# Altium project Robonauts.PrjPcb
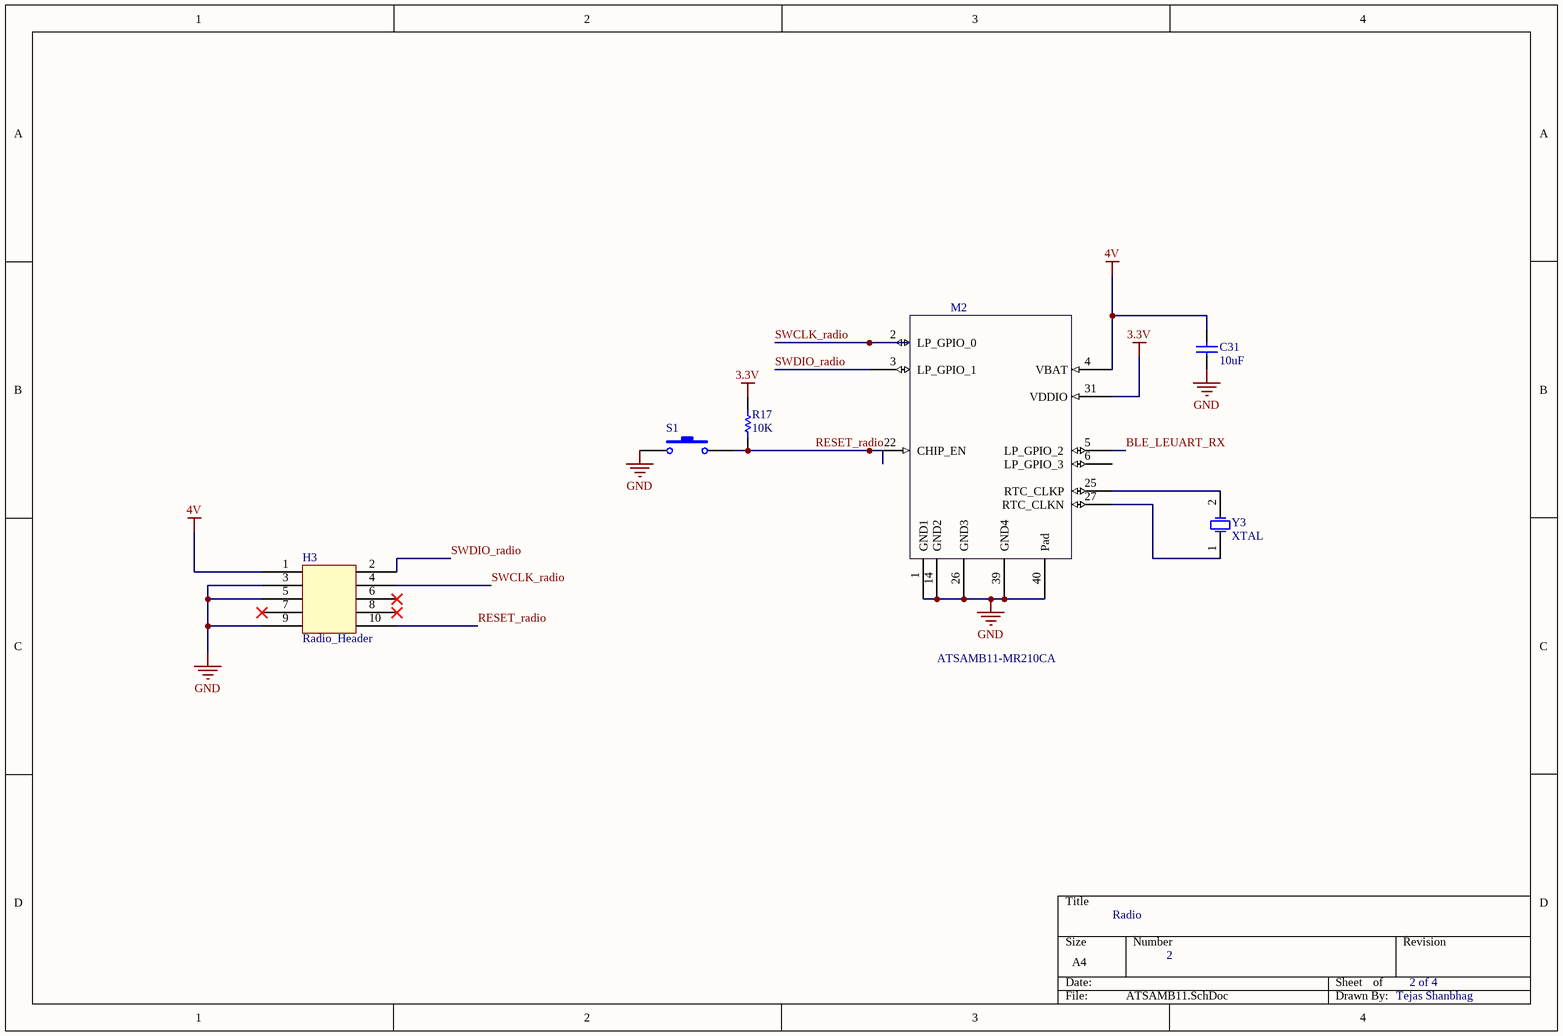
[diagram p0: ATSAMB11.SchDoc]
4 sheets, 119 parts. Net scope: global (net labels, ports and power ports of the same name join across sheets).
Board file: PCB1_Tejas.PcbDoc
Sheets:
  ATSAMB11.SchDoc
  sensors.SchDoc
  powermanage.SchDoc
  Microcontroller_rev2.SchDoc

## Sheet ATSAMB11.SchDoc
size A4

### Parts
C31  value 10uF  [1608[0603]]  (hidden comment: Cap Semi)
H3  Radio_Header  [Cortex Debug Header]
M2  ATSAMB11-MR210CA  [ATMELSAMB11]
R17  value 10K  [1608[0603]]  (hidden comment: Res1)
S1  SW-PB  [RESET]  (value not drawn)
Y3  XTAL  [Clock_LFXTAL]

### Nets
3.3V: M2.31(VDDIO) R17.2
4V: C31.2 H3.1 M2.4(VBAT)
GND: C31.1 H3.3 H3.5 H3.9 M2.1(GND1) M2.14(GND2) M2.26(GND3) M2.39(GND4) M2.40(Pad) S1.1
BLE_LEUART_RX: M2.5(LP_GPIO_2)
RESET_radio: H3.10 M2.22(CHIP_EN) R17.1 S1.2
SWCLK_radio: H3.4 M2.2(LP_GPIO_0)
SWDIO_radio: H3.2 M2.3(LP_GPIO_1)
NetM2_25: M2.25(RTC_CLKP) Y3.2(OSC2)
NetM2_27: M2.27(RTC_CLKN) Y3.1(OSC1)

Not connected (* = marked no-connect by the designer): H3 6* 7* 8*; M2 6(LP_GPIO_3)

### Notes on the sheet
- Radio
- 2
- 2 of 4
- Tejas Shanbhag

### Library data of the parts
C31 = Cap Semi: CAP CER 10UF 10V X5R 0603; Manufacturer: Murata Electronics North America; Manufacturer Part Number: GRM188R61A106KE69D; ComponentLink1Description: Datasheet; ComponentLink1URL: http://search.murata.co.jp/Ceramy/image/img/A01X/partnumbering_e_01.pdf; Digikey Part No: 490-10474-1-ND
H3 = Radio_Header: CONN HDR 1.27MM SMD AU 10POS; Manufacturer: Harwin Inc.; Manufacturer Part Number: M50-3600542; ComponentLink1Description: Datasheet; ComponentLink1URL: https://cdn.harwin.com/pdfs/M50-360.pdf; Digikey Part No: 952-1389-ND
M2 = ATSAMB11: Bluetooth / 802.15.1 Modules Chip Antenna UFL connector MU-T; Manufacturer: Microchip Technology/Atmel; Manufacturer Part Number: ATSAMB11-MR210CA; Mouser Part No: 556-ATSAMB11-MR210CA; ComponentLink1URL: http://www.mouser.com/ProductDetail/Atmel/ATSAMB11-MR210CA/?qs=ma0NyvTRVt1T4DTX%252bAca0w==; ComponentLink1Description: link
R17 = Res1: RES SMD 10K OHM 1% 1/10W 0603; Manufacturer: Yageo; Manufacturer Part Number: RC0603FR-0710KL; ComponentLink1Description: Datasheet; ComponentLink1URL: http://www.yageo.com.tw/exep/pages/download/literatures/PYu-R_INT-thick_7.pdf; Digikey Part No: 311-10.0KHRCT-ND
S1 = SW-PB: SWITCH TACTILE SPST-NO 0.05A 15V; Manufacturer Part Number: TL3315NF160Q; Manufacturer: E-Switch; ComponentLink1Description: Datasheet; ComponentLink1URL: https://media.digikey.com/pdf/Data%20Sheets/E-Switch%20PDFs/TL3315.pdf; Digikey Part No: EG4621CT-ND
Y3 = XTAL: CRYSTAL 32.7680KHZ 12.5PF SMD; Manufacturer Part Number: AB26TRQ-32.768KHZ-T; Manufacturer: Abracon LLC; Value: 32.768kHz; ComponentLink1URL: https://www.digikey.com/products/en/crystals-oscillators-resonators/crystals/171?k=+AB26TRQ&k=&pkeyword=+AB26TRQ&pv7=2&mnonly=0&newproducts=0&ColumnSort=0&page=1&quantity=0&ptm=0&fid=0&pageSize=25; Digikey Part No: 535-12051-1-ND; ComponentLink1Description: link

## Sheet sensors.SchDoc
size A4
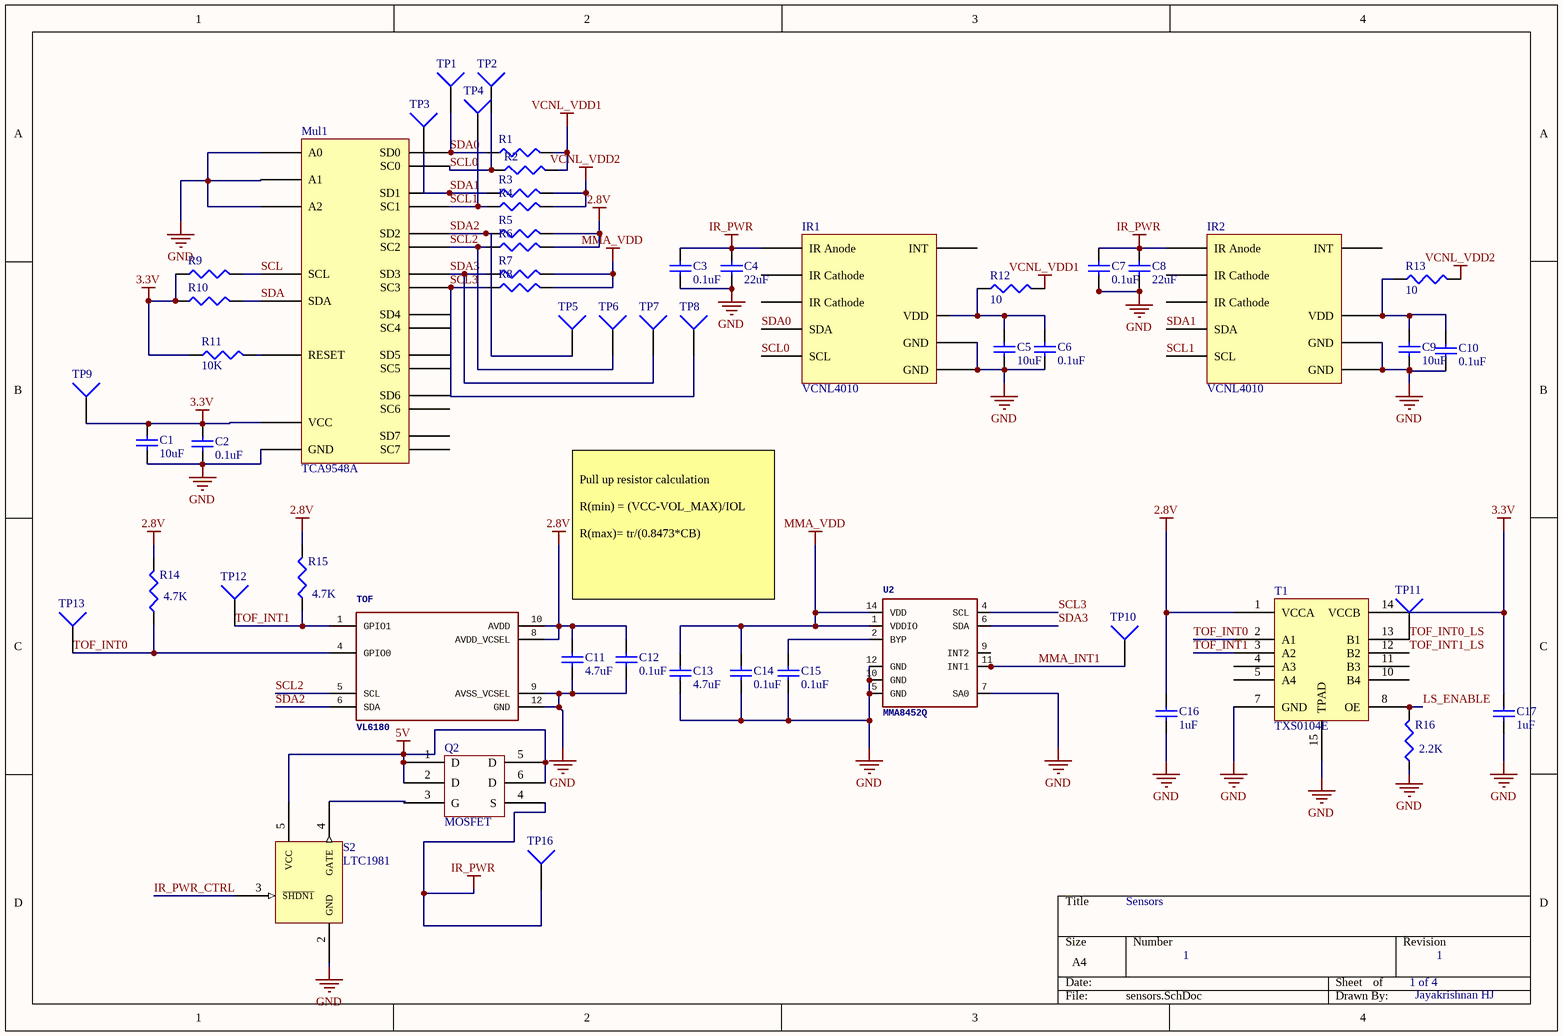
[diagram p1: sensors.SchDoc]

### Parts
C1  value 10uF  [1608[0603]]  (hidden comment: Cap Semi)
C2  value 0.1uF  [1608[0603]]  (hidden comment: Cap Semi)
C3  value 0.1uF  [1608[0603]]  (hidden comment: Cap Semi)
C4  value 22uF  [1608[0603]]  (hidden comment: Cap Semi)
C5  value 10uF  [1608[0603]]  (hidden comment: Cap Semi)
C6  value 0.1uF  [1608[0603]]  (hidden comment: Cap Semi)
C7  value 0.1uF  [1608[0603]]  (hidden comment: Cap Semi)
C8  value 22uF  [1608[0603]]  (hidden comment: Cap Semi)
C9  value 10uF  [1608[0603]]  (hidden comment: Cap Semi)
C10  value 0.1uF  [1608[0603]]  (hidden comment: Cap Semi)
C11  value 4.7uF  [1608[0603]]  (hidden comment: Cap Semi)
C12  value 0.1uF  [1608[0603]]  (hidden comment: Cap Semi)
C13  value 4.7uF  [1608[0603]]  (hidden comment: Cap Semi)
C14  value 0.1uF  [1608[0603]]  (hidden comment: Cap Semi)
C15  value 0.1uF  [1608[0603]]  (hidden comment: Cap Semi)
C16  value 1uF  [1608[0603]]  (hidden comment: Cap Semi)
C17  value 1uF  [1608[0603]]  (hidden comment: Cap Semi)
IR1  VCNL4010  [13-WQFN]
IR2  VCNL4010  [13-WQFN]
Mul1  TCA9548A  [TTSOP MULTIPLEXER]
Q2  MOSFET  [MOSFET SI3442]
R1  Res3  [J1-0603]  (value not drawn)
R2  Res3  [J1-0603]  (value not drawn)
R3  Res3  [J1-0603]  (value not drawn)
R4  Res3  [J1-0603]  (value not drawn)
R5  Res3  [J1-0603]  (value not drawn)
R6  Res3  [J1-0603]  (value not drawn)
R7  Res3  [J1-0603]  (value not drawn)
R8  Res3  [J1-0603]  (value not drawn)
R9  Res3  [J1-0603]  (value not drawn)
R10  Res3  [J1-0603]  (value not drawn)
R11  value 10K  [J1-0603]  (hidden comment: Res3)
R12  value 10  [J1-0603]  (hidden comment: Res3)
R13  value 10  [J1-0603]  (hidden comment: Res3)
R14  value 4.7K  [1608[0603]]  (hidden comment: Res3)
R15  value 4.7K  [1608[0603]]  (hidden comment: Res3)
R16  value 2.2K  [J1-0603]  (hidden comment: Res3)
S2  LTC1981  [LTC1981]
T1  TXS0104E  [txs0104e]
TOF  VL6180  [VL6180]
TP1  Socket  [PIN1]  (value not drawn)
TP2  Socket  [PIN1]  (value not drawn)
TP3  Socket  [PIN1]  (value not drawn)
TP4  Socket  [PIN1]  (value not drawn)
TP5  Socket  [PIN1]  (value not drawn)
TP6  Socket  [PIN1]  (value not drawn)
TP7  Socket  [PIN1]  (value not drawn)
TP8  Socket  [PIN1]  (value not drawn)
TP9  Socket  [PIN1]  (value not drawn)
TP10  Socket  [PIN1]  (value not drawn)
TP11  Socket  [PIN1]  (value not drawn)
TP12  Socket  [PIN1]  (value not drawn)
TP13  Socket  [PIN1]  (value not drawn)
TP16  Socket  [PIN1]  (value not drawn)
U2  MMA8452Q  [MMA8452Q_jk]

### Nets
2.8V: C11.2 C12.2 C16.2 R5.2 R6.2 R14.2 R15.2 T1.1(VCCA) TOF.8(AVDD_VCSEL) TOF.10(AVDD)
3.3V: C1.2 C2.2 C17.2 Mul1.24(VCC) R9.1 R10.1 R11.1 T1.14(VCCB) TP9.1
5V: Q2.1(D) Q2.2(D) Q2.5(D) Q2.6(D) S2.5(VCC)
GND: C1.1 C2.1 C3.1 C4.1 C5.1 C6.1 C7.1 C8.1 C9.1 C10.1 C11.1 C12.1 C13.1 C14.1 C15.1 C16.1 C17.1 IR1.12(GND) IR1.13(GND) IR2.12(GND) IR2.13(GND) Mul1.1(A0) Mul1.2(A1) Mul1.12(GND) Mul1.21(A2) R16.1 S2.2(GND) T1.7(GND) T1.15(TPAD) TOF.9(AVSS_VCSEL) TOF.12(GND) U2.5(GND) U2.7(SA0) U2.10(GND) U2.12(GND)
IR_PWR: C3.2 C4.2 C7.2 C8.2 IR1.1(IR_Anode) IR2.1(IR_Anode) Q2.4(S) TP16.1
MMA_VDD: C13.2 C14.2 R7.2 R8.2 U2.1(VDDIO) U2.14(VDD)
VCNL_VDD1: R1.2 R2.2 R12.2
VCNL_VDD2: R3.2 R4.2 R13.2
IR_PWR_CTRL: S2.3(~{SHDN1})
LS_ENABLE: R16.2 T1.8(OE)
MMA_INT1: TP10.1 U2.11(INT1)
SCL: Mul1.22(SCL) R9.2
SCL0: IR1.5(SCL) Mul1.5(SC0) R2.1 TP2.1
SCL1: IR2.5(SCL) Mul1.7(SC1) R4.1 TP4.1
SCL2: Mul1.9(SC2) R6.1 TOF.5(SCL) TP6.1
SCL3: Mul1.11(SC3) R8.1 TP8.1 U2.4(SCL)
SDA: Mul1.23(SDA) R10.2
SDA0: IR1.4(SDA) Mul1.4(SD0) R1.1 TP1.1
SDA1: IR2.4(SDA) Mul1.6(SD1) R3.1 TP3.1
SDA2: Mul1.8(SD2) R5.1 TOF.6(SDA) TP5.1
SDA3: Mul1.10(SD3) R7.1 TP7.1 U2.6(SDA)
TOF_INT0: R14.1 T1.2(A1) TOF.4(GPIO0) TP13.1
TOF_INT0_LS: T1.13(B1) TP11.1
TOF_INT1: R15.1 T1.3(A2) TOF.1(GPIO1) TP12.1
TOF_INT1_LS: T1.12(B2)
NetC5_2: C5.2 C6.2 IR1.7(VDD) R12.1
NetC9_2: C9.2 C10.2 IR2.7(VDD) R13.1
NetC15_2: C15.2 U2.2(BYP)
NetMul1_3: Mul1.3(RESET) R11.2
NetQ2_3: Q2.3(G) S2.4(GATE)

Not connected (* = marked no-connect by the designer): IR1 2(IR_Cathode) 3(IR_Cathode) 6(INT); IR2 2(IR_Cathode) 3(IR_Cathode) 6(INT); Mul1 13(SD4) 14(SC4) 15(SD5) 16(SC5) 17(SD6) 18(SC6) 19(SD7) 20(SC7); T1 4(A3) 5(A4) 10(B4) 11(B3); U2 9(INT2)

### Notes on the sheet
- Pull up resistor calculation
  R(min) = (VCC-VOL_MAX)/IOL
  R(max)= tr/(0.8473*CB)
- Sensors
- 1
- 1 of 4
- Jayakrishnan HJ

### Library data of the parts
C1 C5 C9 = Cap Semi: as C31 on sheet ATSAMB11; ComponentLink1Description: Datasheet; ComponentLink1URL: http://search.murata.co.jp/Ceramy/image/img/A01X/partnumbering_e_01.pdf; Digikey Part No: 490-10474-1-ND
C2 C3 C6 C7 C10 C12 C14 C15 = Cap Semi: CAP CER 0.1UF 10V X7R 0603; Manufacturer: KEMET; Manufacturer Part Number: C0603C104K8RACTU; ComponentLink1Description: Datasheet; ComponentLink1URL: http://www.kemet.com/Lists/ProductCatalog/Attachments/53/KEM_C1002_X7R_SMD.pdf; Digikey Part No: 399-1095-1-ND
C4 C8 = Cap Semi: CAP CER 22UF 6.3V X5R 0603; Manufacturer: Murata Electronics North America; Manufacturer Part Number: GRM188R60J226MEA0D; ComponentLink1Description: Datasheet; ComponentLink1URL: http://search.murata.co.jp/Ceramy/image/img/A01X/partnumbering_e_01.pdf; Digikey Part No: 490-7611-1-ND
C11 C13 = Cap Semi: CAP CER 4.7UF 10V X5R 0603; Manufacturer: Murata Electronics North America; Manufacturer Part Number: GRM188R61A475KE15D; ComponentLink1Description: Datasheet; ComponentLink1URL: http://search.murata.co.jp/Ceramy/image/img/A01X/partnumbering_e_01.pdf; Digikey Part No: 490-10477-1-ND
C16 C17 = Cap Semi: CAP CER 1UF 10V X7R 0603; Manufacturer: Samsung Electro-Mechanics America, Inc.; Manufacturer Part Number: CL10B105KP8NNNC; ComponentLink1Description: Datasheet; ComponentLink1URL: http://www.digikey.com/product-detail/en/samsung-electro-mechanics-america-inc/CL10B105KP8NNNC/1276-1946-1-ND/3890032; Digikey Part No: 1276-1946-1-ND
IR1 = VCNL4010: SENS IR PROXIMITY AMB LT 12LLP; Manufacturer: Vishay Semiconductor Opto Division; Manufacturer Part Number: VCNL4010-GS08; Digikey Part Number: VCNL4010-GS08CT-ND; ComponentLink1Description: Datasheet; ComponentLink1URL: https://www.digikey.com/products/en/sensors-transducers/optical-sensors-ambient-light-ir-uv-sensors/536?k=vcnl+4010&k=&pkeyword=vcnl+4010&pv7=2&pv16=14926&FV=ffe00218&mnonly=0&newproducts=0&ColumnSort=0&page=1&quantity=0&ptm=0&fid=0&pageSize=25; Value: *
IR2 = VCNL4010: SENS IR PROXIMITY AMB LT 12LLP; Manufacturer Part Number: VCNL4010-GS08; Manufacturer: Vishay Semiconductor Opto Division; ComponentLink1Description: link; Digikey Part No: VCNL4010-GS08CT-ND; ComponentLink1URL: https://www.digikey.com/products/en/sensors-transducers/optical-sensors-ambient-light-ir-uv-sensors/536?k=vcnl+4010&k=&pkeyword=vcnl+4010&pv7=2&pv16=14926&FV=ffe00218&mnonly=0&newproducts=0&ColumnSort=0&page=1&quantity=0&ptm=0&fid=0&pageSize=25
Mul1 = TCA9548A: IC I2C SW 8CH W/RESET 24TSSOP; Manufacturer: Texas Instruments; Manufacturer Part Number: TCA9548APWR; Digikey Part Number: 296-34905-1-ND; ComponentLink1Description: LINK; ComponentLink1URL: https://www.digikey.com/products/en/integrated-circuits-ics/logic-signal-switches-multiplexers-decoders/743?k=tca9548a&k=&pkeyword=tca9548a&pv7=2&pv1291=24&FV=ffe002e7&mnonly=0&newproducts=0&ColumnSort=0&page=1&quantity=0&ptm=0&fid=0&pageSize=25; Value: *
Q2 = MOSFET: MOSFET N-CH 20V 3A 6-TSOP; Manufacturer Part Number: SI3442BDV-T1-E3; Manufacturer: Vishay Siliconix; ComponentLink1URL: https://www.digikey.com/product-detail/en/vishay-siliconix/SI3442BDV-T1-E3/SI3442BDV-T1-E3CT-ND/1656865; Digikey Part No: SI3442BDV-T1-E3CT-ND; Value: *; ComponentLink1Description: link
R1-R10 R14 R15 = Res3: RES SMD 4.7K OHM 5% 1/10W 0603; Manufacturer: Yageo; Manufacturer Part Number: RC0603JR-074K7L; ComponentLink1URL: http://www.digikey.com/product-detail/en/yageo/RC0603JR-074K7L/311-4.7KGRCT-ND/729732; ComponentLink1Description: Datasheet; Digikey Part No: 311-4.7KGRCT-ND
  R1-R10: Value: 4.7K
R11 = Res3: RES SMD 10K OHM 5% 1/16W 0402; Manufacturer: Yageo; Manufacturer Part Number: RC0402JR-0710KL; ComponentLink1URL: http://www.digikey.com/product-detail/en/yageo/RC0402JR-0710KL/311-10KJRCT-ND/729365; ComponentLink1Description: Datasheet; Digikey Part No: 311-10KJRCT-ND
R12 R13 = Res3: RES SMD 10 OHM 1% 1/10W 0603; Manufacturer: Yageo; Manufacturer Part Number: RC0603FR-0710RL; ComponentLink1URL: http://www.digikey.com/product-detail/en/yageo/RC0603FR-0710RL/311-10.0HRCT-ND/729826; ComponentLink1Description: Datasheet; Digikey Part No: 311-10.0HRCT-ND
R16 = Res3: RES SMD 2.2K OHM 1% 1/16W 0402; Manufacturer: Yageo; Manufacturer Part Number: RC0402FR-072K2L; ComponentLink1URL: http://www.digikey.com/product-detail/en/yageo/RC0402FR-072K2L/311-2.20KLRCT-ND/729500; ComponentLink1Description: Datasheet; Digikey Part No: 311-2.20KLRCT-ND
S2 = LTC1981: IC HI-SIDE SW CTRL SNGL TSOT23-5; Manufacturer Part Number: LTC1981ES5#TRMPBF; Manufacturer: Linear Technology; ComponentLink1Description: link; ComponentLink1URL: https://www.digikey.com/products/en/integrated-circuits-ics/pmic-gate-drivers/730?k=ltc1981&k=&pkeyword=ltc1981&pv7=2&mnonly=0&newproducts=0&ColumnSort=0&page=1&quantity=0&ptm=0&fid=0&pageSize=25; Value: *; Digikey Part No: LTC1981ES5#TRMPBFCT-ND
T1 = TXS0104E: IC 4BIT NON-INV TRANSLTR 14-QFN; Manufacturer Part Number: TXS0104ERGYR; Manufacturer: Texas Instruments; Value: *; ComponentLink1Description: link; ComponentLink1URL: https://www.digikey.com/product-detail/en/texas-instruments/TXS0104ERGYR/296-20698-1-ND/1143682; Digikey Part No: 296-20698-1-ND
TOF = VL6180: MOD TIME-OF-FLIGHT 3IN1 12LGA; Manufacturer: STMicroelectronics; Manufacturer Part Number: VL6180XV0NR/1; Digikey Part No: 497-14702-1-ND; ComponentLink1Description: link; Value: *; ComponentLink1URL: https://www.digikey.com/product-detail/en/stmicroelectronics/VL6180XV0NR-1/497-14702-1-ND/4854910
U2 = MMA8452Q: ACCELEROMETER 2-8G I2C 16QFN; Manufacturer: NXP USA Inc.; Manufacturer Part Number: MMA8452QR1; ComponentLink1URL: https://www.digikey.com/products/en/sensors-transducers/motion-sensors-accelerometers/515?k=mma8452Q&k=&pkeyword=mma8452Q&pv7=2&FV=ffe00203&mnonly=0&newproducts=0&ColumnSort=0&page=1&quantity=0&ptm=0&fid=0&pageSize=25; ComponentLink1Description: link; Digikey Part No: MMA8452QR1CT-ND; Value: *
TP1-TP13 TP16 = Socket: LatestRevisionDate: 17-Jul-2002; LatestRevisionNote: Re-released for DXP Platform.; Publisher: Altium Limited

## Sheet powermanage.SchDoc
size A4
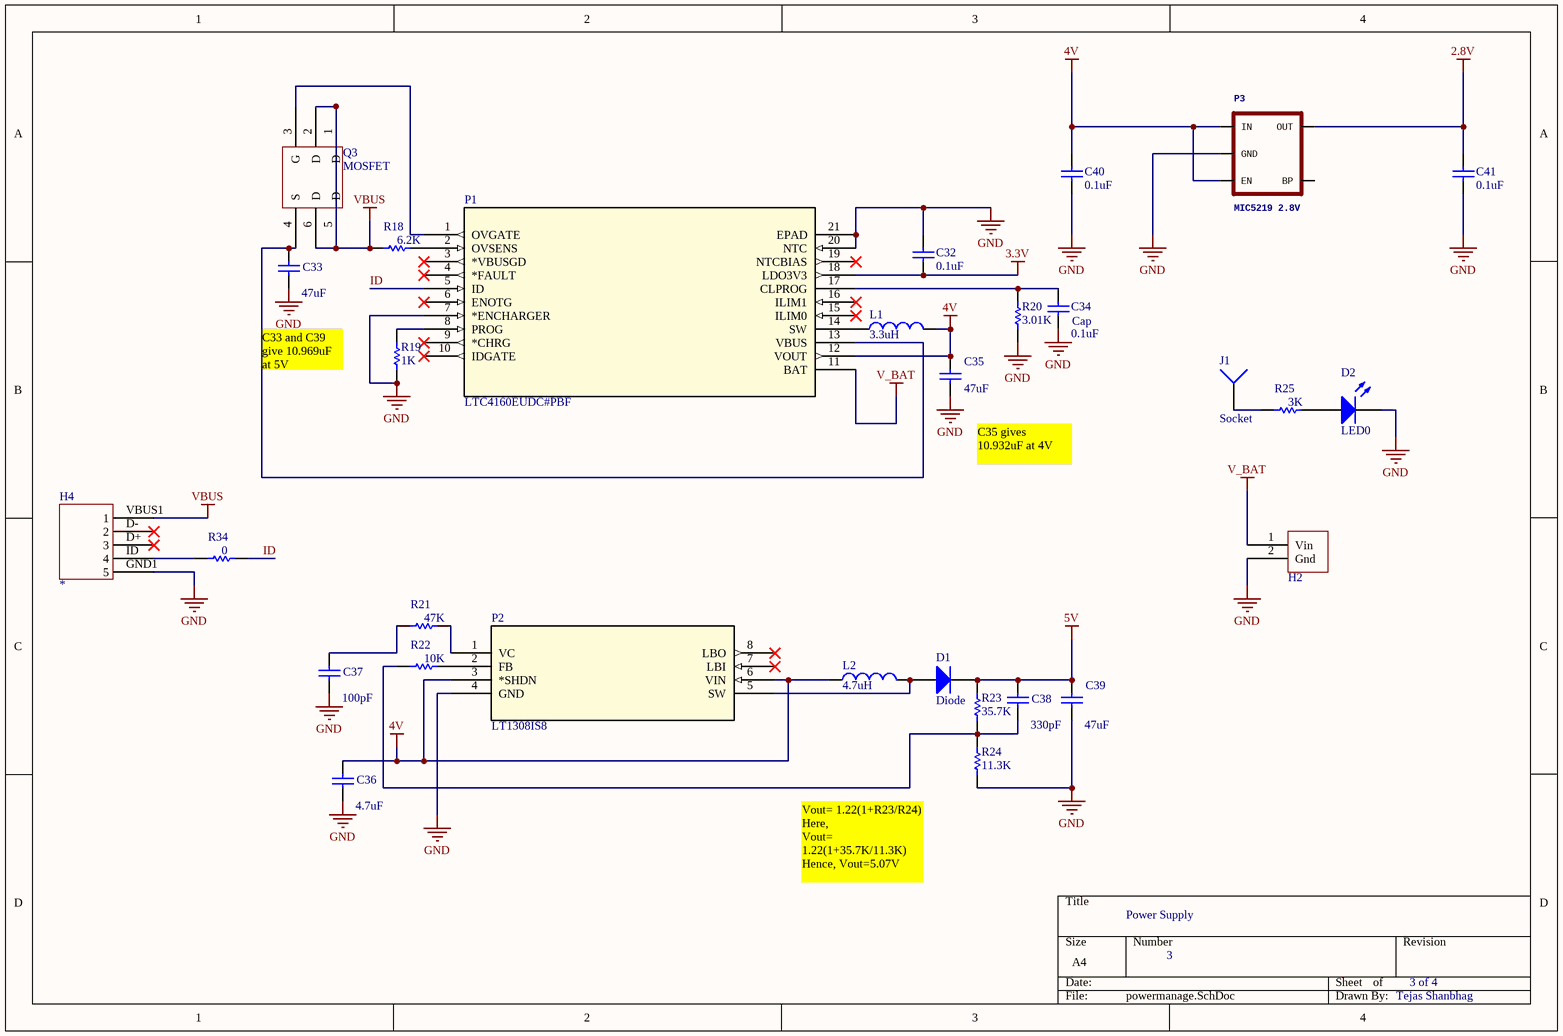
[diagram p2: powermanage.SchDoc]

### Parts
C32  value 0.1uF  [1608[0603]]  (hidden comment: Cap Semi)
C33  value 47uF  [6-0805_L]  (hidden comment: Cap)
C34  Cap  value 0.1uF  [1608[0603]]
C35  value 47uF  [1608[0603]]  (hidden comment: Cap)
C36  value 4.7uF  [1608[0603]]  (hidden comment: Cap)
C37  value 100pF  [1608[0603]]  (hidden comment: Cap)
C38  value 330pF  [1608[0603]]  (hidden comment: Cap)
C39  value 47uF  [6-0805_L]  (hidden comment: Cap)
C40  value 0.1uF  [1608[0603]]  (hidden comment: Cap Semi)
C41  value 0.1uF  [1608[0603]]  (hidden comment: Cap Semi)
D1  Diode  [1608[0603]]
D2  LED0  [LED-0603]
H2  Li-on  [battery]  (value not drawn)
H4  *  [MicroUSB_ConnOld]
J1  Socket  [PIN1]
L1  value 3.3uH  [1608[0603]]  (hidden comment: Inductor)
L2  value 4.7uH  [1608[0603]]  (hidden comment: Inductor)
P1  LTC4160EUDC#PBF  [LTC4160]
P2  LT1308IS8  [LTC1308]
P3  MIC5219 2.8V  [SOT23-5]
Q3  MOSFET  [MOSFET SI3442]
R18  value 6.2K  [1608[0603]]  (hidden comment: Res1)
R19  value 1K  [1608[0603]]  (hidden comment: Res1)
R20  value 3.01K  [1608[0603]]  (hidden comment: Res1)
R21  value 47K  [1608[0603]]  (hidden comment: Res1)
R22  value 10K  [1608[0603]]  (hidden comment: Res1)
R23  value 35.7K  [1608[0603]]  (hidden comment: Res1)
R24  value 11.3K  [1608[0603]]  (hidden comment: Res1)
R25  value 3K  [1608[0603]]  (hidden comment: Res1)
R34  value 0  [1608[0603]]  (hidden comment: Res1)

### Nets
2.8V: C41.2 P3.5(OUT)
3.3V: C32.1 P1.18(LDO3V3)
4V: C35.2 C36.2 C40.2 L1.2 L2.1 P1.12(VOUT) P2.3(*SHDN) P2.6(VIN) P3.1(IN) P3.3(EN)
5V: C38.2 C39.2 D1.2(K) R23.2
GND: C32.2 C33.1 C34.2 C35.1 C36.1 C37.1 C39.1 C40.1 C41.1 D2.2(K) H2.2(Gnd) H4.GND1(5) P1.7(*ENCHARGER) P1.20(NTC) P1.21(EPAD) P2.4(GND) P3.2(GND) R19.1 R20.2 R24.1
V_BAT: H2.1(Vin) P1.11(BAT)
VBUS: H4.VBUS1(1) Q3.1(D) Q3.2(D) Q3.5(D) Q3.6(D) R18.1
ID: P1.5(ID) R34.2
NetC33_2: C33.2 P1.13(VBUS) Q3.4(S)
NetC34_1: C34.1 P1.17(CLPROG) R20.1
NetC37_2: C37.2 R21.1
NetC38_1: C38.1 R22.1 R23.1 R24.2
NetD1_1: D1.1(A) L2.2 P2.5(SW)
NetD2_1: D2.1(A) R25.2
NetH4_ID: H4.ID(4) R34.1
NetJ1_1: J1.1 R25.1
NetL1_1: L1.1 P1.14(SW)
NetP1_1: P1.1(OVGATE) Q3.3(G)
NetP1_2: P1.2(OVSENS) R18.2
NetP1_8: P1.8(PROG) R19.2
NetP2_1: P2.1(VC) R21.2
NetP2_2: P2.2(FB) R22.2

Not connected (* = marked no-connect by the designer): H4 D+(3)* D-(2)*; P1 3(*VBUSGD)* 4(*FAULT)* 6(ENOTG)* 9(*CHRG)* 10(IDGATE)* 15(ILIM0)* 16(ILIM1)* 19(NTCBIAS)*; P2 7(LBI)* 8(LBO)*; P3 4(BP)

### Notes on the sheet
- C33 and C39 give 10.969uF at 5V
- (near C35) C35 gives 10.932uF at 4V
- Vout= 1.22(1+R23/R24)
  Here,
  Vout= 1.22(1+35.7K/11.3K)
  Hence, Vout=5.07V
- Power Supply
- 3
- 3 of 4
- Tejas Shanbhag

### Library data of the parts
C32 C40 C41 = Cap Semi: as C2 on sheet sensors; ComponentLink1Description: Datasheet; ComponentLink1URL: http://www.kemet.com/Lists/ProductCatalog/Attachments/53/KEM_C1002_X7R_SMD.pdf; Digikey Part No: 399-1095-1-ND
C33 C39 = Cap: CAP CER 47UF 6.3V X5R 0805; Manufacturer Part Number: GRM219R60J476ME44D; Manufacturer: Murata Electronics North America; Digikey Part No: 490-13249-1-ND; ComponentLink1Description: Datasheet; ComponentLink1URL: http://search.murata.co.jp/Ceramy/image/img/A01X/partnumbering_e_01.pdf
C34 = Cap: CAP CER 0.1UF 16V X7R 0603; Manufacturer Part Number: CC0603KRX7R7BB104; Manufacturer: Yageo; ComponentLink1Description: Datasheet; ComponentLink1URL: http://www.yageo.com/documents/recent/UPY-GPHC_X7R_6.3V-to-50V_17.pdf; Digikey Part No: 311-1088-1-ND
C35 = Cap: CAP CER 22UF 6.3V X5R 1206; Manufacturer Part Number: GRM188R60J476ME15D; Manufacturer: Murata Electronics North America; Digikey Part No: 490-13247-1-ND; ComponentLink1Description: Datasheet; ComponentLink1URL: http://search.murata.co.jp/Ceramy/image/img/A01X/partnumbering_e_01.pdf
C36 = Cap: CAP CER 4.7UF 6.3V X7R 0603; Manufacturer Part Number: CL10B475KQ8NQNC; Manufacturer: Samsung Electro-Mechanics America, Inc.; Digikey Part No: 1276-2087-1-ND; ComponentLink1Description: Datasheet; ComponentLink1URL: http://media.digikey.com/pdf/Data%20Sheets/Samsung%20PDFs/CL10B475KQ8NQNC_Spec.pdf
C37 = Cap: CAP CER 100PF 50V X7R 0603; Manufacturer Part Number: C0603C101K5RACTU; Manufacturer: KEMET; Digikey Part No: 399-7824-1-ND; ComponentLink1Description: Datasheet; ComponentLink1URL: http://www.kemet.com/docfinder?Partnumber=C0603C101K5RACTU
C38 = Cap: CAP CER 330PF 100V X7R 0603; Manufacturer Part Number: CL10B331KC8WPNC; Manufacturer: Samsung Electro-Mechanics America, Inc.; Digikey Part No: 1276-6658-1-ND; ComponentLink1Description: Datasheet; ComponentLink1URL: http://www.samsungsem.com/kr/support/library/product-catalog/__icsFiles/afieldfile/2016/09/27/MLCC.pdf
D1 = Diode: Default Diode; Manufacturer: Bourns Inc.; Manufacturer Part Number: CD0603-S01575; ComponentLink1Description: Datasheet; ComponentLink1URL: http://www.bourns.com/docs/Product-Datasheets/CD0603_1005.pdf; Digikey Part No: CD0603-S01575CT-ND
D2 = LED0: Typical INFRARED GaAs LED; Manufacturer: Wurth Electronics Inc.; Manufacturer Part Number: 150060YS75000; ComponentLink1Description: Datasheet; ComponentLink1URL: http://katalog.we-online.de/led/datasheet/150060YS75000.pdf; Digikey Part No: 732-4981-1-ND
H2 = battery: Manufacturer: JST Sales America Inc.; Manufacturer Part Number: S2B-PH-K-S(LF)(SN); ComponentLink1Description: Datasheet; ComponentLink1URL: http://www.jst-mfg.com/product/pdf/eng/ePH.pdf; Digikey Part No: 455-1719-ND
H4 = USB-AB-MICRO: CONN RCPT USB MICRO AB SMD R/A; Manufacturer Part Number: ZX62-AB-5PA(31); Manufacturer: Hirose Electric Co Ltd; Digikey Part No: H125279CT-ND; ComponentLink1URL: https://www.hirose.com/product/en/download_file/key_name/ZX/category/Catalog/doc_file_id/31704/?file_category_id=4&item_id=13&is_series=1; ComponentLink1Description: Datasheet
L1 = Inductor: FIXED IND 3.3UH 30MA 1.3 OHM SMD; Manufacturer: Taiyo Yuden; Manufacturer Part Number: LK16083R3K-T; ComponentLink1Description Datasheet: Datasheet; ComponentLink1URL: http://www.yuden.co.jp/productdata/catalog/en/mlci01_e.pdf; Digikey Part No: 587-1584-1-ND
L2 = Inductor: FIXED IND 4.7UH 350MA 500 MOHM; Manufacturer: TDK Corporation; Manufacturer Part Number: MLZ1608M4R7WT000; ComponentLink1Description Datasheet: Datasheet; ComponentLink1URL: https://product.tdk.com/info/en/catalog/datasheets/inductor_commercial_decoupling_mlz1608_en.pdf; Digikey Part No: 445-6390-1-ND
P1 = LTC4160EUDC#PBF: IC SWITCH POWER MANAGER 20-QFN; Manufacturer: Linear Technology; ComponentLink1Description: Datasheet; ComponentLink1URL: http://www.linear.com/docs/27893; Digikey Part No: TC4160EUDC#PBF-ND; Manufacturer Part Number: LTC4160EUDC#PBF
P2 = LT1308IS8: IC REG BOOST ADJ 2A 8SOIC; Manufacturer Part Number: LT1308IS8#PBF; Manufacturer: Linear Technology; Digikey Part No: LT1308IS8#PBF-ND; ComponentLink1Description: Datasheet; ComponentLink1URL: http://www.linear.com/docs/1489
P3 = V_REG_MIC52193.3V: V_REG MIC5219Standard 3.3V and 5V 500mA LDO voltage regulator in SOT-23 layout. Micrel part MIC5219. BP (by-pass) pinMIC5219-2.8YM5-TR; Manufacturer: Microchip Technology; Manufacturer Part Number: MIC5219-2.8YM5-TR; Digikey Part No: 576-2762-1-ND; ComponentLink1URL: http://www.microchip.com/mymicrochip/filehandler.aspx?ddocname=en579712; ComponentLink1Description: Datasheet
Q3 = MOSFET: as Q2 on sheet sensors; ComponentLink1URL: https://www.digikey.com/product-detail/en/vishay-siliconix/SI3442BDV-T1-E3/SI3442BDV-T1-E3CT-ND/1656865; Digikey Part No: SI3442BDV-T1-E3CT-ND; Value: *; ComponentLink1Description: link
R18 = Res1: RES SMD 6.2K OHM 1% 1/10W 0603; Manufacturer: Yageo; Manufacturer Part Number: RC0603FR-076K2L; ComponentLink1Description: Datasheet; ComponentLink1URL: http://www.yageo.com.tw/exep/pages/download/literatures/PYu-R_INT-thick_7.pdf; Digikey Part No: 311-6.20KHRCT-ND
R19 = Res1: RES SMD 1K OHM 1% 1/10W 0603; Manufacturer: Yageo; Manufacturer Part Number: RC0603FR-071KL; ComponentLink1Description: Datasheet; ComponentLink1URL: http://www.yageo.com.tw/exep/pages/download/literatures/PYu-R_INT-thick_7.pdf; Digikey Part No: 311-1.00KHRCT-ND
R20 = Res1: RES SMD 3.01K OHM 1% 1/10W 0603; Manufacturer: Yageo; Manufacturer Part Number: RC0603FR-073K01L; ComponentLink1Description: Datasheet; ComponentLink1URL: http://www.yageo.com.tw/exep/pages/download/literatures/PYu-R_INT-thick_7.pdf; Digikey Part No: 311-3.01KHRCT-ND
R21 R34 = Res1: RES SMD 47K OHM 1% 1/10W 0603; Manufacturer: Yageo; Manufacturer Part Number: RC0603FR-0747KL; ComponentLink1Description: Datasheet; ComponentLink1URL: http://www.yageo.com.tw/exep/pages/download/literatures/PYu-R_INT-thick_7.pdf; Digikey Part No: 311-47.0KHRCT-ND
R22 R25 = Res1: as R17 on sheet ATSAMB11; ComponentLink1Description: Datasheet; ComponentLink1URL: http://www.yageo.com.tw/exep/pages/download/literatures/PYu-R_INT-thick_7.pdf; Digikey Part No: 311-10.0KHRCT-ND
R23 = Res1: RES SMD 35.7K OHM 1% 1/10W 0603; Manufacturer: Yageo; Manufacturer Part Number: RC0603FR-0735K7L; ComponentLink1Description: Datasheet; ComponentLink1URL: http://www.yageo.com.tw/exep/pages/download/literatures/PYu-R_INT-thick_7.pdf; Digikey Part No: 311-35.7KHRCT-ND
R24 = Res1: RES SMD 11.3K OHM 1% 1/10W 0603; Manufacturer: Yageo; Manufacturer Part Number: RC0603FR-0711K3L; ComponentLink1Description: Datasheet; ComponentLink1URL: http://www.yageo.com.tw/exep/pages/download/literatures/PYu-R_INT-thick_7.pdf; Digikey Part No: 311-11.3KHRCT-ND
J1 = Socket: LatestRevisionDate: 17-Jul-2002; LatestRevisionNote: Re-released for DXP Platform.; Publisher: Altium Limited

## Sheet Microcontroller_rev2.SchDoc
size A4
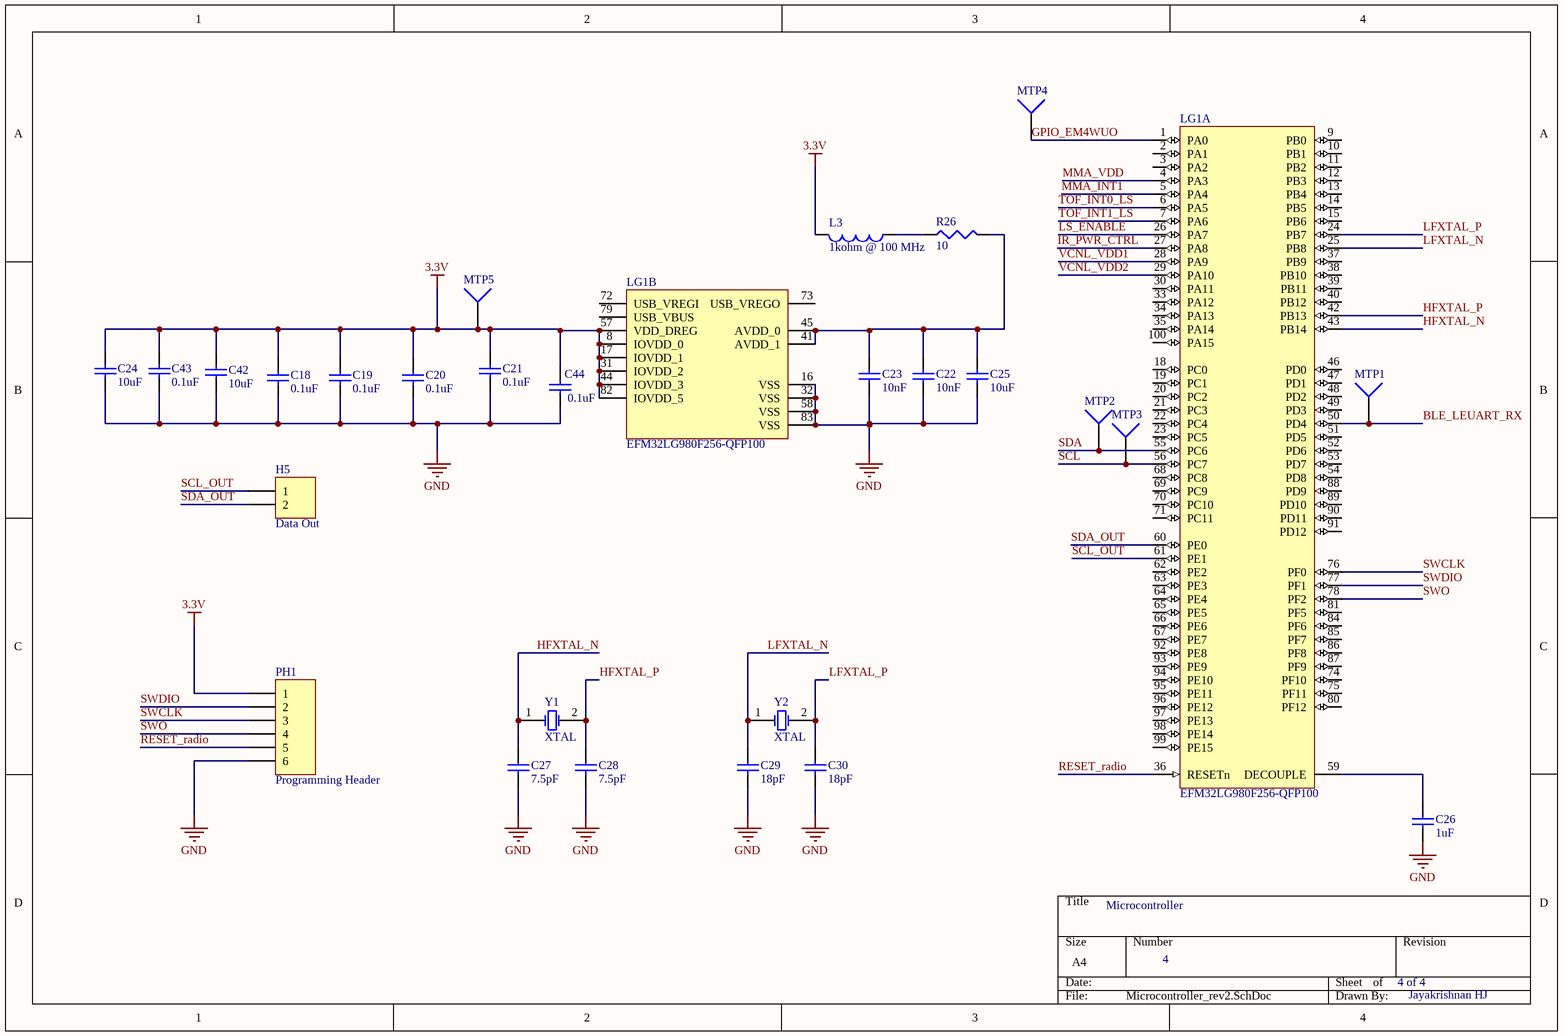
[diagram p3: Microcontroller_rev2.SchDoc]

### Parts
C18  value 0.1uF  [1608[0603]]  (hidden comment: Cap Semi)
C19  value 0.1uF  [1608[0603]]  (hidden comment: Cap Semi)
C20  value 0.1uF  [1608[0603]]  (hidden comment: Cap Semi)
C21  value 0.1uF  [1608[0603]]  (hidden comment: Cap Semi)
C22  value 10nF  [1608[0603]]  (hidden comment: Cap Semi)
C23  value 10nF  [1608[0603]]  (hidden comment: Cap Semi)
C24  value 10uF  [1608[0603]]  (hidden comment: Cap Semi)
C25  value 10uF  [1608[0603]]  (hidden comment: Cap Semi)
C26  value 1uF  [1608[0603]]  (hidden comment: Cap Semi)
C27  value 7.5pF  [1608[0603]]  (hidden comment: Cap Semi)
C28  value 7.5pF  [1608[0603]]  (hidden comment: Cap Semi)
C29  value 18pF  [1608[0603]]  (hidden comment: Cap Semi)
C30  value 18pF  [1608[0603]]  (hidden comment: Cap Semi)
C42  value 10uF  [1608[0603]]  (hidden comment: Cap Semi)
C43  value 0.1uF  [1608[0603]]  (hidden comment: Cap Semi)
C44  value 0.1uF  [1608[0603]]  (hidden comment: Cap Semi)
H5  Data Out  [HDR1X2]
L3  value 1kohm @ 100 MHz  [6-0805_M]  (hidden comment: Inductor)
LG1  EFM32LG980F256-QFP100  [ENMR-LQFP100_M]  (parts A,B of 2)
MTP1  Socket  [PIN1]  (value not drawn)
MTP2  Socket  [PIN1]  (value not drawn)
MTP3  Socket  [PIN1]  (value not drawn)
MTP4  Socket  [PIN1]  (value not drawn)
MTP5  Socket  [PIN1]  (value not drawn)
PH1  Programming Header  [HDR1X6]
R26  value 10  [J1-0603]  (hidden comment: Res3)
Y1  XTAL  [Clock_LFXTAL]
Y2  XTAL  [Clock_LFXTAL]

### Nets
3.3V: C18.2 C19.2 C20.2 C21.2 C24.2 C42.2 C43.2 C44.2 L3.2 LG1.8(IOVDD_0) LG1.17(IOVDD_1) LG1.31(IOVDD_2) LG1.44(IOVDD_3) LG1.57(VDD_DREG) LG1.82(IOVDD_5) MTP5.1 PH1.1
GND: C18.1 C19.1 C20.1 C21.1 C22.1 C23.1 C24.1 C25.1 C26.1 C27.1 C28.1 C29.1 C30.1 C42.1 C43.1 C44.1 LG1.16(VSS) LG1.32(VSS) LG1.58(VSS) LG1.83(VSS) PH1.6
MMA_VDD: LG1.4(PA3)
VCNL_VDD1: LG1.28(PA9)
VCNL_VDD2: LG1.29(PA10)
BLE_LEUART_RX: LG1.50(PD4) MTP1.1
GPIO_EM4WUO: LG1.1(PA0) MTP4.1
HFXTAL_N: C27.2 LG1.43(PB14) Y1.1(OSC1)
HFXTAL_P: C28.2 LG1.42(PB13) Y1.2(OSC2)
IR_PWR_CTRL: LG1.27(PA8)
LFXTAL_N: C29.2 LG1.25(PB8) Y2.1(OSC1)
LFXTAL_P: C30.2 LG1.24(PB7) Y2.2(OSC2)
LS_ENABLE: LG1.26(PA7)
MMA_INT1: LG1.5(PA4)
RESET_radio: LG1.36(RESETn) PH1.5
SCL: LG1.56(PC7) MTP3.1
SCL_OUT: H5.1 LG1.61(PE1)
SDA: LG1.55(PC6) MTP2.1
SDA_OUT: H5.2 LG1.60(PE0)
SWCLK: LG1.76(PF0) PH1.3
SWDIO: LG1.77(PF1) PH1.2
SWO: LG1.78(PF2) PH1.4
TOF_INT0_LS: LG1.6(PA5)
TOF_INT1_LS: LG1.7(PA6)
NetC22_2: C22.2 C23.2 C25.2 LG1.41(AVDD_1) LG1.45(AVDD_0) R26.2
NetC26_2: C26.2 LG1.59(DECOUPLE)
NetL3_1: L3.1 R26.1

Not connected (* = marked no-connect by the designer): LG1 2(PA1) 3(PA2) 9(PB0) 10(PB1) 11(PB2) 12(PB3) 13(PB4) 14(PB5) 15(PB6) 18(PC0) 19(PC1) 20(PC2) 21(PC3) 22(PC4) 23(PC5) 30(PA11) 33(PA12) 34(PA13) 35(PA14) 37(PB9) 38(PB10) 39(PB11) 40(PB12) 46(PD0) 47(PD1) 48(PD2) 49(PD3) 51(PD5) 52(PD6) 53(PD7) 54(PD8) 62(PE2) 63(PE3) 64(PE4) 65(PE5) 66(PE6) 67(PE7) 68(PC8) 69(PC9) 70(PC10) 71(PC11) 72(USB_VREGI) 73(USB_VREGO) 74(PF10) 75(PF11) 79(USB_VBUS) 80(PF12) 81(PF5) 84(PF6) 85(PF7) 86(PF8) 87(PF9) 88(PD9) 89(PD10) 90(PD11) 91(PD12) 92(PE8) 93(PE9) 94(PE10) 95(PE11) 96(PE12) 97(PE13) 98(PE14) 99(PE15) 100(PA15)

### Notes on the sheet
- Microcontroller
- 4
- 4 of 4
- Jayakrishnan HJ

### Library data of the parts
C18-C21 C43 C44 = Cap Semi: as C2 on sheet sensors; ComponentLink1Description: Datasheet; ComponentLink1URL: http://www.kemet.com/Lists/ProductCatalog/Attachments/53/KEM_C1002_X7R_SMD.pdf; Digikey Part No: 399-1095-1-ND
C22 C23 = Cap Semi: CAP CER 10000PF 50V X7R 0603; Manufacturer: Yageo; Manufacturer Part Number: CC0603KRX7R9BB103; ComponentLink1Description: Datasheet; ComponentLink1URL: http://www.yageo.com/exep/pages/download/literatures/ProductSelectionGuide%202014_Final_2.pdf; Digikey Part No: 311-1085-1-ND
C24 C25 C42 = Cap Semi: as C31 on sheet ATSAMB11; ComponentLink1Description: Datasheet; ComponentLink1URL: http://search.murata.co.jp/Ceramy/image/img/A01X/partnumbering_e_01.pdf; Digikey Part No: 490-10474-1-ND
C26 = Cap Semi: as C16 on sheet sensors; ComponentLink1Description: Datasheet; ComponentLink1URL: http://www.digikey.com/product-detail/en/samsung-electro-mechanics-america-inc/CL10B105KP8NNNC/1276-1946-1-ND/3890032; Digikey Part No: 1276-1946-1-ND
C27 C28 = Cap Semi: Multilayer Ceramic Capacitors MLCC - SMD/SMT 25V 7.5pF C0G 0201 .1pF Tol; Manufacturer: AVX; Manufacturer Part Number: 02013A7R5BAT2A; ComponentLink1Description: Datasheet; ComponentLink1URL: http://www.mouser.com/ProductDetail/AVX/02013A7R5BAT2A/?qs=sGAEpiMZZMs0AnBnWHyRQB52zW9BgkFE2gr3mrXUPHs%3d; Mouser Part No: 581-02013A7R5BAT2A
C29 C30 = Cap Semi: CAP CER 18PF 250V NP0 0603; Manufacturer: Johanson Technology Inc.; Manufacturer Part Number: 251R14S180GV4T; ComponentLink1Description: Datasheet; ComponentLink1URL: http://www.digikey.com/product-detail/en/johanson-technology-inc/251R14S180GV4T/712-1321-1-ND/1786783; Digikey Part No: 712-1321-1-ND
H5 = Header 2: Header, 2-Pin; LatestRevisionDate: 17-Jul-2002; LatestRevisionNote: Re-released for DXP Platform.; Publisher: Altium Limited
L3 = Inductor: FERRITE BEAD 1 KOHM 0805 1LN; Manufacturer: Murata Electronics North America; Manufacturer Part Number: BLM21BD102SN1D; ComponentLink1Description: Datasheet; ComponentLink1URL: http://www.murata.com/en-global/products/productdata/8796733767710/S0580E.pdf; Digikey Part No: 490-1047-1-ND
LG1 = EFM32LG980F256-QFP100: ARM Microcontrollers - MCU 256k Flash 32k RAM USB 8x34 LCD AES; Manufacturer: Silicon Labs; Manufacturer Part Number: EFM32LG980F256G-E-QFP100; ComponentLink1URL: http://www.mouser.com/ProductDetail/Silicon-Labs/EFM32LG980F256G-E-QFP100/?qs=sGAEpiMZZMuoKKEcg8mMKOIXatb8SC9JzN0ocJGBCFebEz30rQzUmA%3d%3d; Mouser Part No: 634-EFM32LG980F256GE; ComponentLink1Description: link
PH1 = Header 6: Header, 6-Pin; Digikey Part No: *; ComponentLink1Description: *; ComponentLink1URL: *; Manufacturer: *; Manufacturer Part Number: *; Value: *
R26 = Res3: as R12 on sheet sensors; ComponentLink1URL: http://www.digikey.com/product-detail/en/yageo/RC0603FR-0710RL/311-10.0HRCT-ND/729826; ComponentLink1Description: Datasheet; Digikey Part No: 311-10.0HRCT-ND
Y1 = XTAL: Crystal Oscillator; Published: 8-Jun-2000; LatestRevisionDate: 17-Jul-2002; LatestRevisionNote: Re-released for DXP Platform.; PackageReference: R38; Publisher: Altium Limited; PackageDescription: Crystal, Thru-Hole; 2 Leads; Body 3.1 x 8.2 mm (Dia.xH)
Y2 = XTAL: CRYSTAL 32.7680KHZ 12.5PF SMD; Manufacturer: Abracon LLC; Manufacturer Part Number: AB26TRQ-32.768KHZ-T; Digikey Part No: 535-12051-1-ND; ComponentLink1URL: https://www.digikey.com/products/en/crystals-oscillators-resonators/crystals/171?k=+AB26TRQ&k=&pkeyword=+AB26TRQ&pv7=2&mnonly=0&newproducts=0&ColumnSort=0&page=1&quantity=0&ptm=0&fid=0&pageSize=25; ComponentLink1Description: link
MTP1-MTP5 = Socket: LatestRevisionDate: 17-Jul-2002; LatestRevisionNote: Re-released for DXP Platform.; Publisher: Altium Limited

## Nets that join several sheets
2.8V: sensors (10 pins), powermanage (C41.2 P3.5)
3.3V: ATSAMB11 (M2.31 R17.2), sensors (9 pins), powermanage (C32.1 P1.18), Microcontroller_rev2 (17 pins)
4V: ATSAMB11 (C31.2 H3.1 M2.4), powermanage (10 pins)
5V: sensors (5 pins), powermanage (C38.2 C39.2 D1.2 R23.2)
GND: ATSAMB11 (10 pins), sensors (35 pins), powermanage (20 pins), Microcontroller_rev2 (21 pins)
MMA_VDD: sensors (6 pins), Microcontroller_rev2 (LG1.4)
VCNL_VDD1: sensors (R1.2 R2.2 R12.2), Microcontroller_rev2 (LG1.28)
VCNL_VDD2: sensors (R3.2 R4.2 R13.2), Microcontroller_rev2 (LG1.29)
BLE_LEUART_RX: ATSAMB11 (M2.5), Microcontroller_rev2 (LG1.50 MTP1.1)
IR_PWR_CTRL: sensors (S2.3), Microcontroller_rev2 (LG1.27)
LS_ENABLE: sensors (R16.2 T1.8), Microcontroller_rev2 (LG1.26)
MMA_INT1: sensors (TP10.1 U2.11), Microcontroller_rev2 (LG1.5)
RESET_radio: ATSAMB11 (H3.10 M2.22 R17.1 S1.2), Microcontroller_rev2 (LG1.36 PH1.5)
SCL: sensors (Mul1.22 R9.2), Microcontroller_rev2 (LG1.56 MTP3.1)
SDA: sensors (Mul1.23 R10.2), Microcontroller_rev2 (LG1.55 MTP2.1)
TOF_INT0_LS: sensors (T1.13 TP11.1), Microcontroller_rev2 (LG1.6)
TOF_INT1_LS: sensors (T1.12), Microcontroller_rev2 (LG1.7)